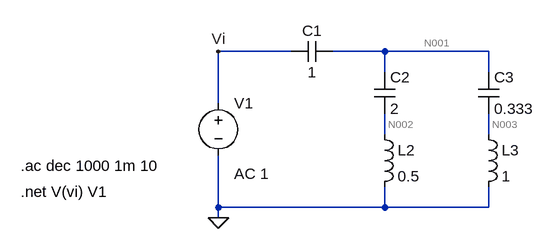
[diagram p0: schematic ej2.asc]
ej2.asc, the LTspice schematic file:
Version 4
SHEET 1 880 680
WIRE 96 64 -16 64
WIRE 240 64 160 64
WIRE 400 64 240 64
WIRE 240 96 240 64
WIRE 400 96 400 64
WIRE -16 144 -16 64
WIRE 240 192 240 160
WIRE 400 192 400 160
WIRE -16 304 -16 224
WIRE 240 304 240 272
WIRE 240 304 -16 304
WIRE 400 304 400 272
WIRE 400 304 240 304
WIRE -16 320 -16 304
FLAG -16 320 0
FLAG -16 64 Vi
SYMBOL cap 224 96 R0
SYMATTR InstName C2
SYMATTR Value 2
SYMBOL cap 384 96 R0
SYMATTR InstName C3
SYMATTR Value 0.333
SYMBOL ind 224 176 R0
SYMATTR InstName L2
SYMATTR Value 0.5
SYMATTR SpiceLine Rser=0
SYMBOL ind 384 176 R0
SYMATTR InstName L3
SYMATTR Value 1
SYMATTR SpiceLine Rser=0
SYMBOL voltage -16 128 R0
WINDOW 123 24 124 Left 2
WINDOW 39 0 0 Left 0
SYMATTR InstName V1
SYMATTR Value ""
SYMATTR Value2 AC 1
SYMBOL cap 160 48 R90
WINDOW 0 0 32 VBottom 2
WINDOW 3 32 32 VTop 2
SYMATTR InstName C1
SYMATTR Value 1
TEXT -320 240 Left 2 !.ac dec 1000 1m 10
TEXT -320 280 Left 2 !.net V(vi) V1

The netlist it stands for:
* ej2.asc
C2 N001 N002 2
C3 N001 N003 0.333
L2 N002 0 0.5 Rser=0
L3 N003 0 1 Rser=0
V1 Vi 0 AC 1
C1 N001 Vi 1
.ac dec 1000 1m 10
.net V(vi) V1
.backanno
.end

* Results of the author's LTspice run, read from the files saved beside the schematic
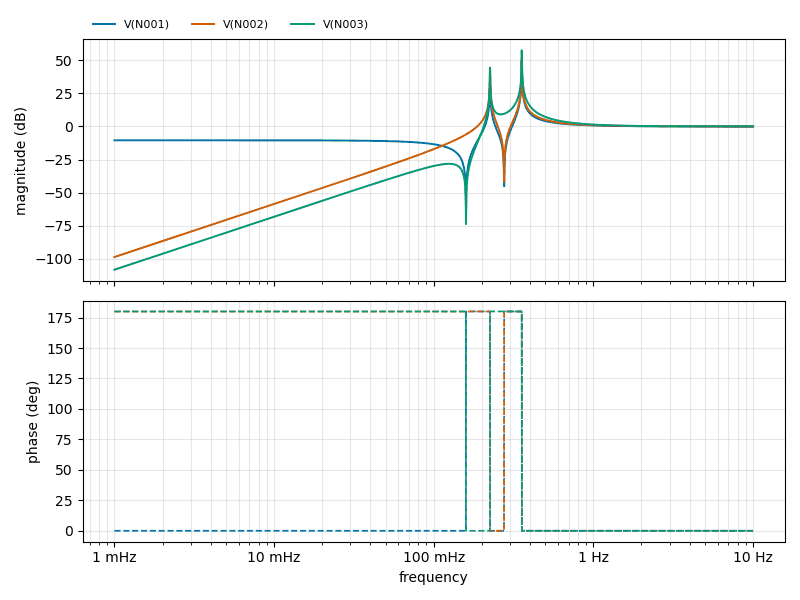
[diagram p1: AC Analysis of ej2.asc, plotted from the saved traces]
* AC Analysis, 1 run:
*   V(N001): -10.46 dB at 1 mHz, 0.01 dB at 10 Hz, peak 49.38 dB at 355.6 mHz, 3 dB below the peak at 355.4 mHz and 356.3 mHz
*   V(N002): -98.53 dB at 1 mHz, 0.01 dB at 10 Hz, peak 51.32 dB at 355.6 mHz, 3 dB below the peak at 355.4 mHz and 356.3 mHz
*   V(N003): -108.08 dB at 1 mHz, 0.01 dB at 10 Hz, peak 57.37 dB at 355.6 mHz, 3 dB below the peak at 355.4 mHz and 356.3 mHz